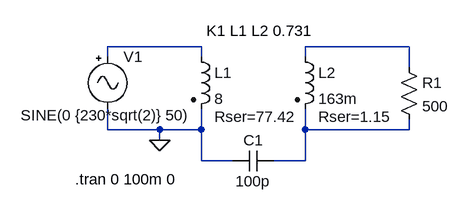
[diagram p0: schematic transformers_example1.asc]
transformers_example1.asc, the LTspice schematic file:
Version 4
SHEET 1 880 680
WIRE 32 112 -112 112
WIRE 352 112 192 112
WIRE -112 128 -112 112
WIRE 32 128 32 112
WIRE 192 128 192 112
WIRE 352 144 352 112
WIRE -112 240 -112 208
WIRE -32 240 -112 240
WIRE 32 240 32 208
WIRE 32 240 -32 240
WIRE 192 240 192 208
WIRE 352 240 352 224
WIRE 352 240 192 240
WIRE -32 256 -32 240
WIRE 32 288 32 240
WIRE 80 288 32 288
WIRE 192 288 192 240
WIRE 192 288 144 288
FLAG -32 256 0
SYMBOL ind2 16 112 R0
WINDOW 39 36 108 Left 2
SYMATTR InstName L1
SYMATTR Value 8
SYMATTR Type ind
SYMATTR SpiceLine Rser=77.42
SYMBOL ind2 176 112 R0
WINDOW 39 36 108 Left 2
SYMATTR InstName L2
SYMATTR Value 163m
SYMATTR Type ind
SYMATTR SpiceLine Rser=1.15
SYMBOL Misc\\signal -112 112 R0
WINDOW 3 -134 106 Left 2
WINDOW 123 0 0 Left 2
WINDOW 39 0 0 Left 2
SYMATTR InstName V1
SYMATTR Value SINE(0 {230*sqrt(2)} 50)
SYMBOL res 336 128 R0
SYMATTR InstName R1
SYMATTR Value 500
SYMBOL cap 144 272 R90
WINDOW 0 0 32 VBottom 2
WINDOW 3 32 32 VTop 2
SYMATTR InstName C1
SYMATTR Value 100p
TEXT 40 88 Left 2 !K1 L1 L2 0.731
TEXT -162 316 Left 2 !.tran 0 100m 0

The netlist it stands for:
* transformers_example1.asc
L1 N001 0 8 Rser=77.42
L2 N002 N003 163m Rser=1.15
V1 N001 0 SINE(0 {230*sqrt(2)} 50)
R1 N002 N003 500
C1 N003 0 100p
K1 L1 L2 0.731
.tran 0 100m 0
.backanno
.end